# Altium schematic sheet yyb_v2.5_leds.SchDoc: Extension connectors
size A4; DocumentNumber: MB1136; Revision: C.3; SheetNumber: 4; SheetTotal: 4; Project: NUCLEO-XXXXRX
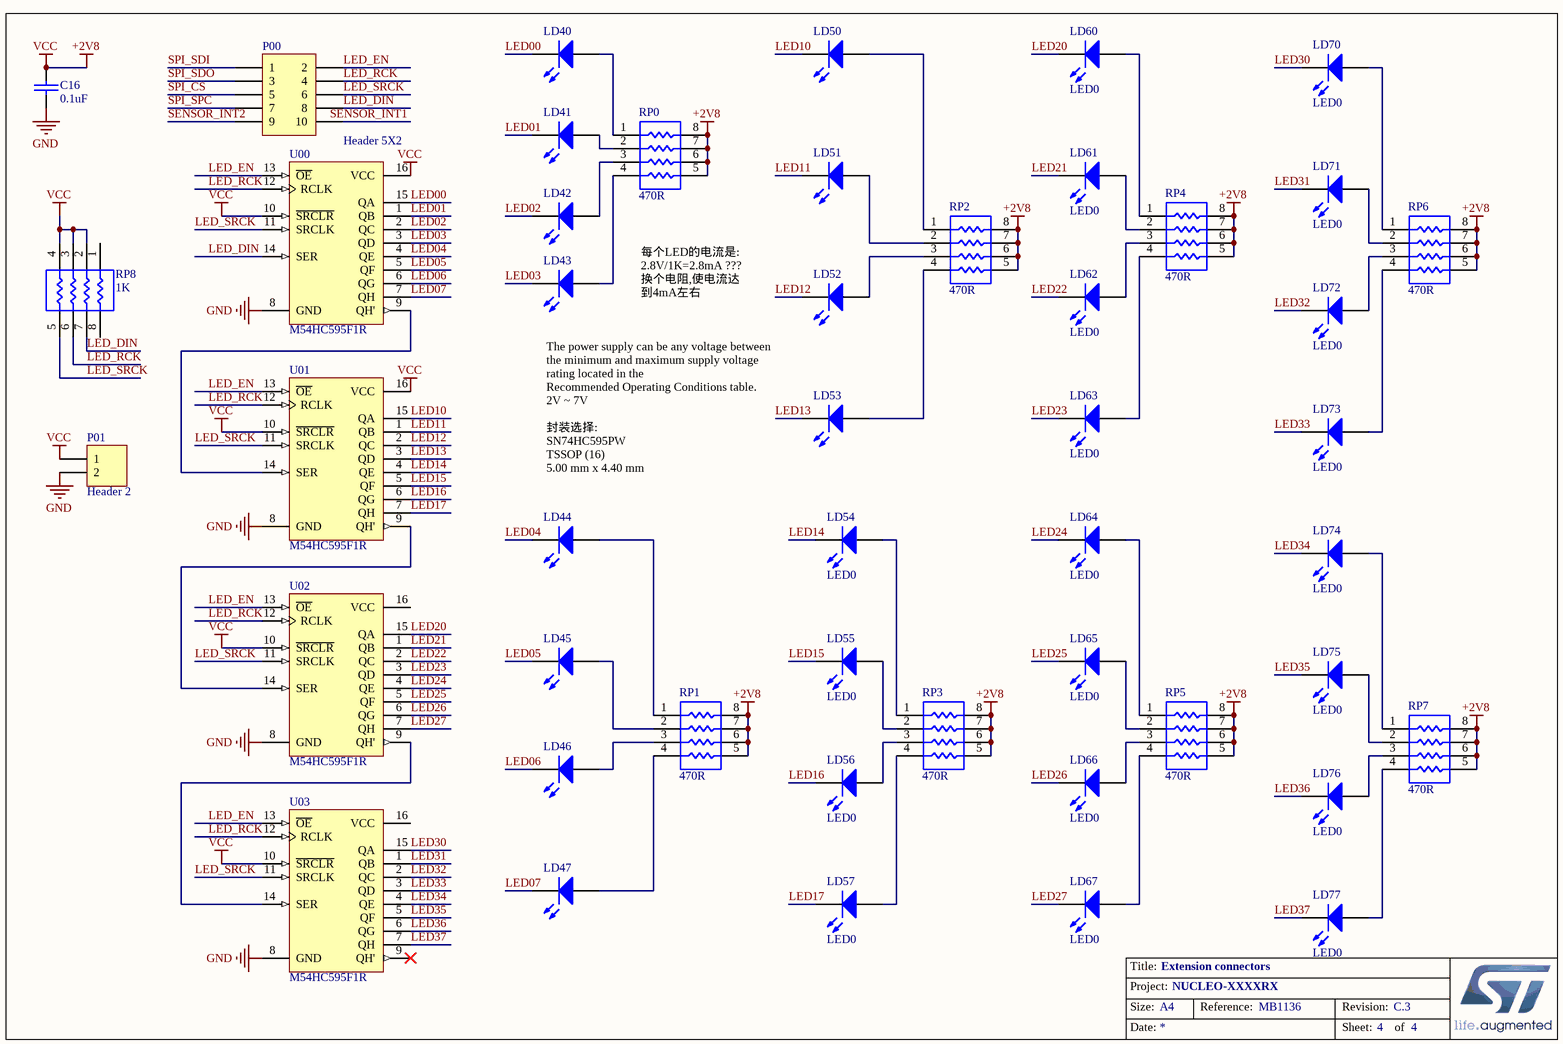
[diagram p0: yyb_v2.5_leds.SchDoc]

## Parts
C16  0.1uF  [0603C]
LD40  LED0  [LED5]  (value not drawn)
LD41  LED0  [LED5]  (value not drawn)
LD42  LED0  [LED5]  (value not drawn)
LD43  LED0  [LED5]  (value not drawn)
LD44  LED0  [LED5]  (value not drawn)
LD45  LED0  [LED5]  (value not drawn)
LD46  LED0  [LED5]  (value not drawn)
LD47  LED0  [LED5]  (value not drawn)
LD50  LED0  [LED5]  (value not drawn)
LD51  LED0  [LED5]  (value not drawn)
LD52  LED0  [LED5]  (value not drawn)
LD53  LED0  [LED5]  (value not drawn)
LD54  LED0  [LED5]
LD55  LED0  [LED5]
LD56  LED0  [LED5]
LD57  LED0  [LED5]
LD60  LED0  [LED5]
LD61  LED0  [LED5]
LD62  LED0  [LED5]
LD63  LED0  [LED5]
LD64  LED0  [LED5]
LD65  LED0  [LED5]
LD66  LED0  [LED5]
LD67  LED0  [LED5]
LD70  LED0  [LED5]
LD71  LED0  [LED5]
LD72  LED0  [LED5]
LD73  LED0  [LED5]
LD74  LED0  [LED5]
LD75  LED0  [LED5]
LD76  LED0  [LED5]
LD77  LED0  [LED5]
P00  Header 5X2  [HDR2X5]
P01  Header 2  [HDR1X2]
RP0  470R  [4P8]
RP1  470R  [4P8]
RP2  470R  [4P8]
RP3  470R  [4P8]
RP4  470R  [4P8]
RP5  470R  [4P8]
RP6  470R  [4P8]
RP7  470R  [4P8]
RP8  1K  [4P8]
U00  M54HC595F1R  [DIP16]
U01  M54HC595F1R  [DIP16]
U02  M54HC595F1R  [DIP16]
U03  M54HC595F1R  [DIP16]

## Nets
+2V8: C16.1 P01.1 RP0.5 RP0.6 RP0.7 RP0.8 RP1.5 RP1.6 RP1.7 RP1.8 RP2.5 RP2.6 RP2.7 RP2.8 RP3.5 RP3.6 RP3.7 RP3.8 RP4.5 RP4.6 RP4.7 RP4.8 RP5.5 RP5.6 RP5.7 RP5.8 RP6.5 RP6.6 RP6.7 RP6.8 RP7.5 RP7.6 RP7.7 RP7.8 RP8.2 RP8.3 RP8.4 U00.10(~{SRCLR}) U00.16(VCC) U01.10(~{SRCLR}) U01.16(VCC) U02.10(~{SRCLR}) U03.10(~{SRCLR})  [also labelled VCC]
GND: C16.2 P01.2 U00.8(GND) U01.8(GND) U02.8(GND) U03.8(GND)
LED00: LD40.2(K) U00.15(QA)
LED01: LD41.2(K) U00.1(QB)
LED02: LD42.2(K) U00.2(QC)
LED03: LD43.2(K) U00.3(QD)
LED04: LD44.2(K) U00.4(QE)
LED05: LD45.2(K) U00.5(QF)
LED06: LD46.2(K) U00.6(QG)
LED07: LD47.2(K) U00.7(QH)
LED10: LD50.2(K) U01.15(QA)
LED11: LD51.2(K) U01.1(QB)
LED12: LD52.2(K) U01.2(QC)
LED13: LD53.2(K) U01.3(QD)
LED14: LD54.2(K) U01.4(QE)
LED15: LD55.2(K) U01.5(QF)
LED16: LD56.2(K) U01.6(QG)
LED17: LD57.2(K) U01.7(QH)
LED20: LD60.2(K) U02.15(QA)
LED21: LD61.2(K) U02.1(QB)
LED22: LD62.2(K) U02.2(QC)
LED23: LD63.2(K) U02.3(QD)
LED24: LD64.2(K) U02.4(QE)
LED25: LD65.2(K) U02.5(QF)
LED26: LD66.2(K) U02.6(QG)
LED27: LD67.2(K) U02.7(QH)
LED30: LD70.2(K) U03.15(QA)
LED31: LD71.2(K) U03.1(QB)
LED32: LD72.2(K) U03.2(QC)
LED33: LD73.2(K) U03.3(QD)
LED34: LD74.2(K) U03.4(QE)
LED35: LD75.2(K) U03.5(QF)
LED36: LD76.2(K) U03.6(QG)
LED37: LD77.2(K) U03.7(QH)
LED_DIN: P00.8 RP8.7 U00.14(SER)
LED_EN: P00.2 U00.13(~{OE}) U01.13(~{OE}) U02.13(~{OE}) U03.13(~{OE})
LED_RCK: P00.4 RP8.6 U00.12(RCLK) U01.12(RCLK) U02.12(RCLK) U03.12(RCLK)
LED_SRCK: P00.6 RP8.5 U00.11(SRCLK) U01.11(SRCLK) U02.11(SRCLK) U03.11(SRCLK)
SENSOR_INT2: P00.9
SPI_CS: P00.5
SPI_SDI: P00.1
SPI_SDO: P00.3
SPI_SPC: P00.7
NetLD40_1: LD40.1(A) RP0.1
NetLD41_1: LD41.1(A) RP0.2
NetLD42_1: LD42.1(A) RP0.3
NetLD43_1: LD43.1(A) RP0.4
NetLD44_1: LD44.1(A) RP1.1
NetLD45_1: LD45.1(A) RP1.2
NetLD46_1: LD46.1(A) RP1.3
NetLD47_1: LD47.1(A) RP1.4
NetLD50_1: LD50.1(A) RP2.1
NetLD51_1: LD51.1(A) RP2.2
NetLD52_1: LD52.1(A) RP2.3
NetLD53_1: LD53.1(A) RP2.4
NetLD54_1: LD54.1(A) RP3.1
NetLD55_1: LD55.1(A) RP3.2
NetLD56_1: LD56.1(A) RP3.3
NetLD57_1: LD57.1(A) RP3.4
NetLD60_1: LD60.1(A) RP4.1
NetLD61_1: LD61.1(A) RP4.2
NetLD62_1: LD62.1(A) RP4.3
NetLD63_1: LD63.1(A) RP4.4
NetLD64_1: LD64.1(A) RP5.1
NetLD65_1: LD65.1(A) RP5.2
NetLD66_1: LD66.1(A) RP5.3
NetLD67_1: LD67.1(A) RP5.4
NetLD70_1: LD70.1(A) RP6.1
NetLD71_1: LD71.1(A) RP6.2
NetLD72_1: LD72.1(A) RP6.3
NetLD73_1: LD73.1(A) RP6.4
NetLD74_1: LD74.1(A) RP7.1
NetLD75_1: LD75.1(A) RP7.2
NetLD76_1: LD76.1(A) RP7.3
NetLD77_1: LD77.1(A) RP7.4
NetU00_9: U00.9(QH') U01.14(SER)
NetU01_9: U01.9(QH') U02.14(SER)
NetU02_9: U02.9(QH') U03.14(SER)

Not connected (* = marked no-connect by the designer): P00 10; RP8 1 8; U02 16(VCC); U03 9(QH')* 16(VCC)

## Notes on the sheet
- 每个LED的电流是:
  2.8V/1K=2.8mA ???
  换个电阻,使电流达到4mA左右
- The power supply can be any voltage between the minimum and maximum supply voltage rating located in the
  Recommended Operating Conditions table.
  2V ~ 7V
  封装选择:
  SN74HC595PW
  TSSOP (16)
  5.00 mm x 4.40 mm
- Labels drawn without touching a wire or pin: SENSOR_INT1
- Title:
- Project:
- Size:
- Date:
- A4
- Reference:
- Sheet:
- Revision:
- of

## Library data of the parts
C16 = CAP: Capacitor
LD40-LD47 LD50-LD57 LD60-LD67 LD70-LD77 = LED0: Typical INFRARED GaAs LED; Published: 8-Jun-2000; LatestRevisionDate: 08-Jul-2005; LatestRevisionNote: Mech Layer 1 removed.; PackageReference: LED-0; Publisher: Altium Limited; PackageDescription: LED; 2 Leads
P00 = Header 5X2: Header, 5-Pin, Dual row; LatestRevisionDate: 17-Jul-2002; LatestRevisionNote: Re-released for DXP Platform.; Publisher: Altium Limited
P01 = Header 2: Header, 2-Pin; LatestRevisionDate: 17-Jul-2002; LatestRevisionNote: Re-released for DXP Platform.; Publisher: Altium Limited
RP0-RP8 = RESPACK3_1
U00 U01 U02 U03 = M54HC595F1R: 8 Bit Shift Register with Output Latches (3 STATE); Published: 8-Jun-2000; LatestRevisionDate: 06-Jun-2005; LatestRevisionNote: Stylized 3D Model Added.; DatasheetVersion: Apr-1993; PackageVersion: Apr-1996; PackageReference: DIP16; Publisher: Altium Limited; PackageDescription: DIP; 16 Leads; Row Spacing 7.62 mm; Pitch 2.54 mm; ComponentLink1Description: Manufacturer Link; ComponentLink1URL: http://www.st.com/